# EAGLE schematic udayworks60 (EAGLE 9.6.2)
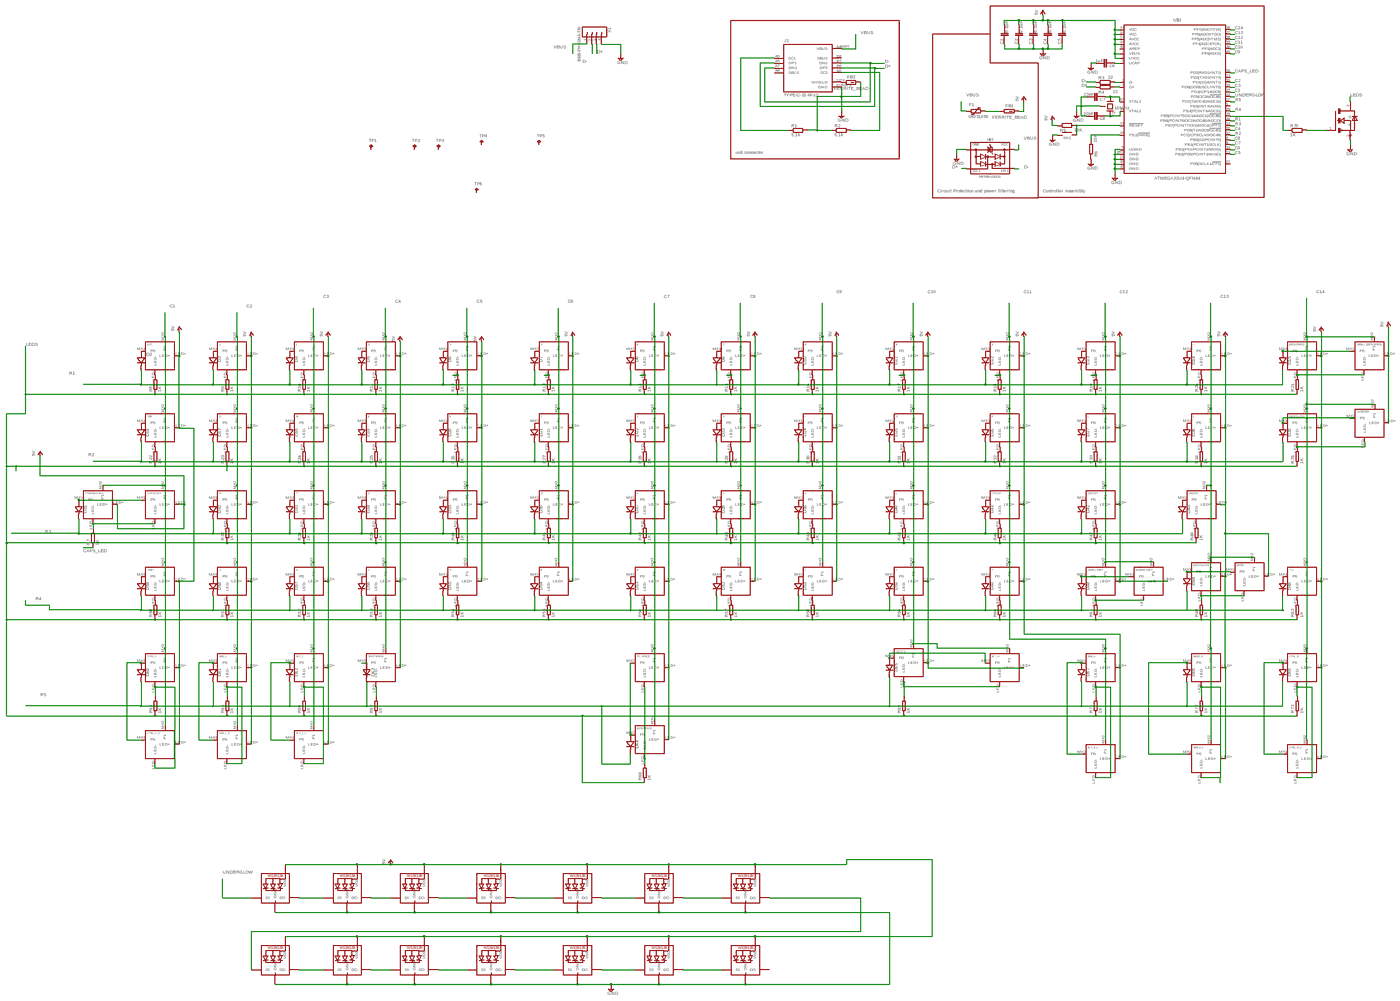
[diagram p0: schematic, sheet 1, overview]
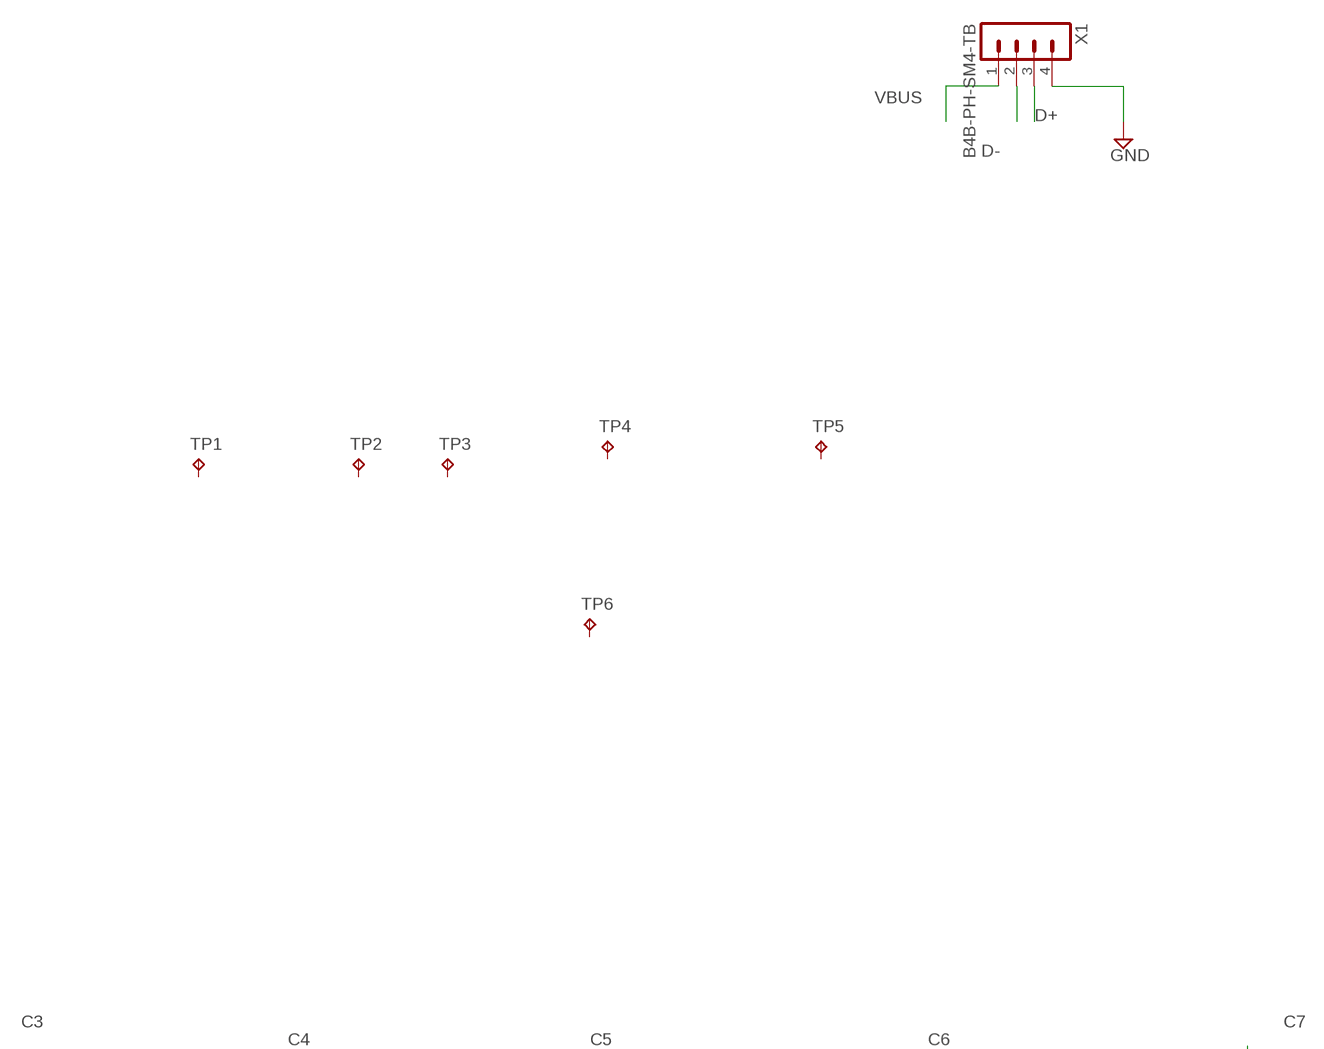
[diagram p1: schematic, sheet 1, part 1 of 4]
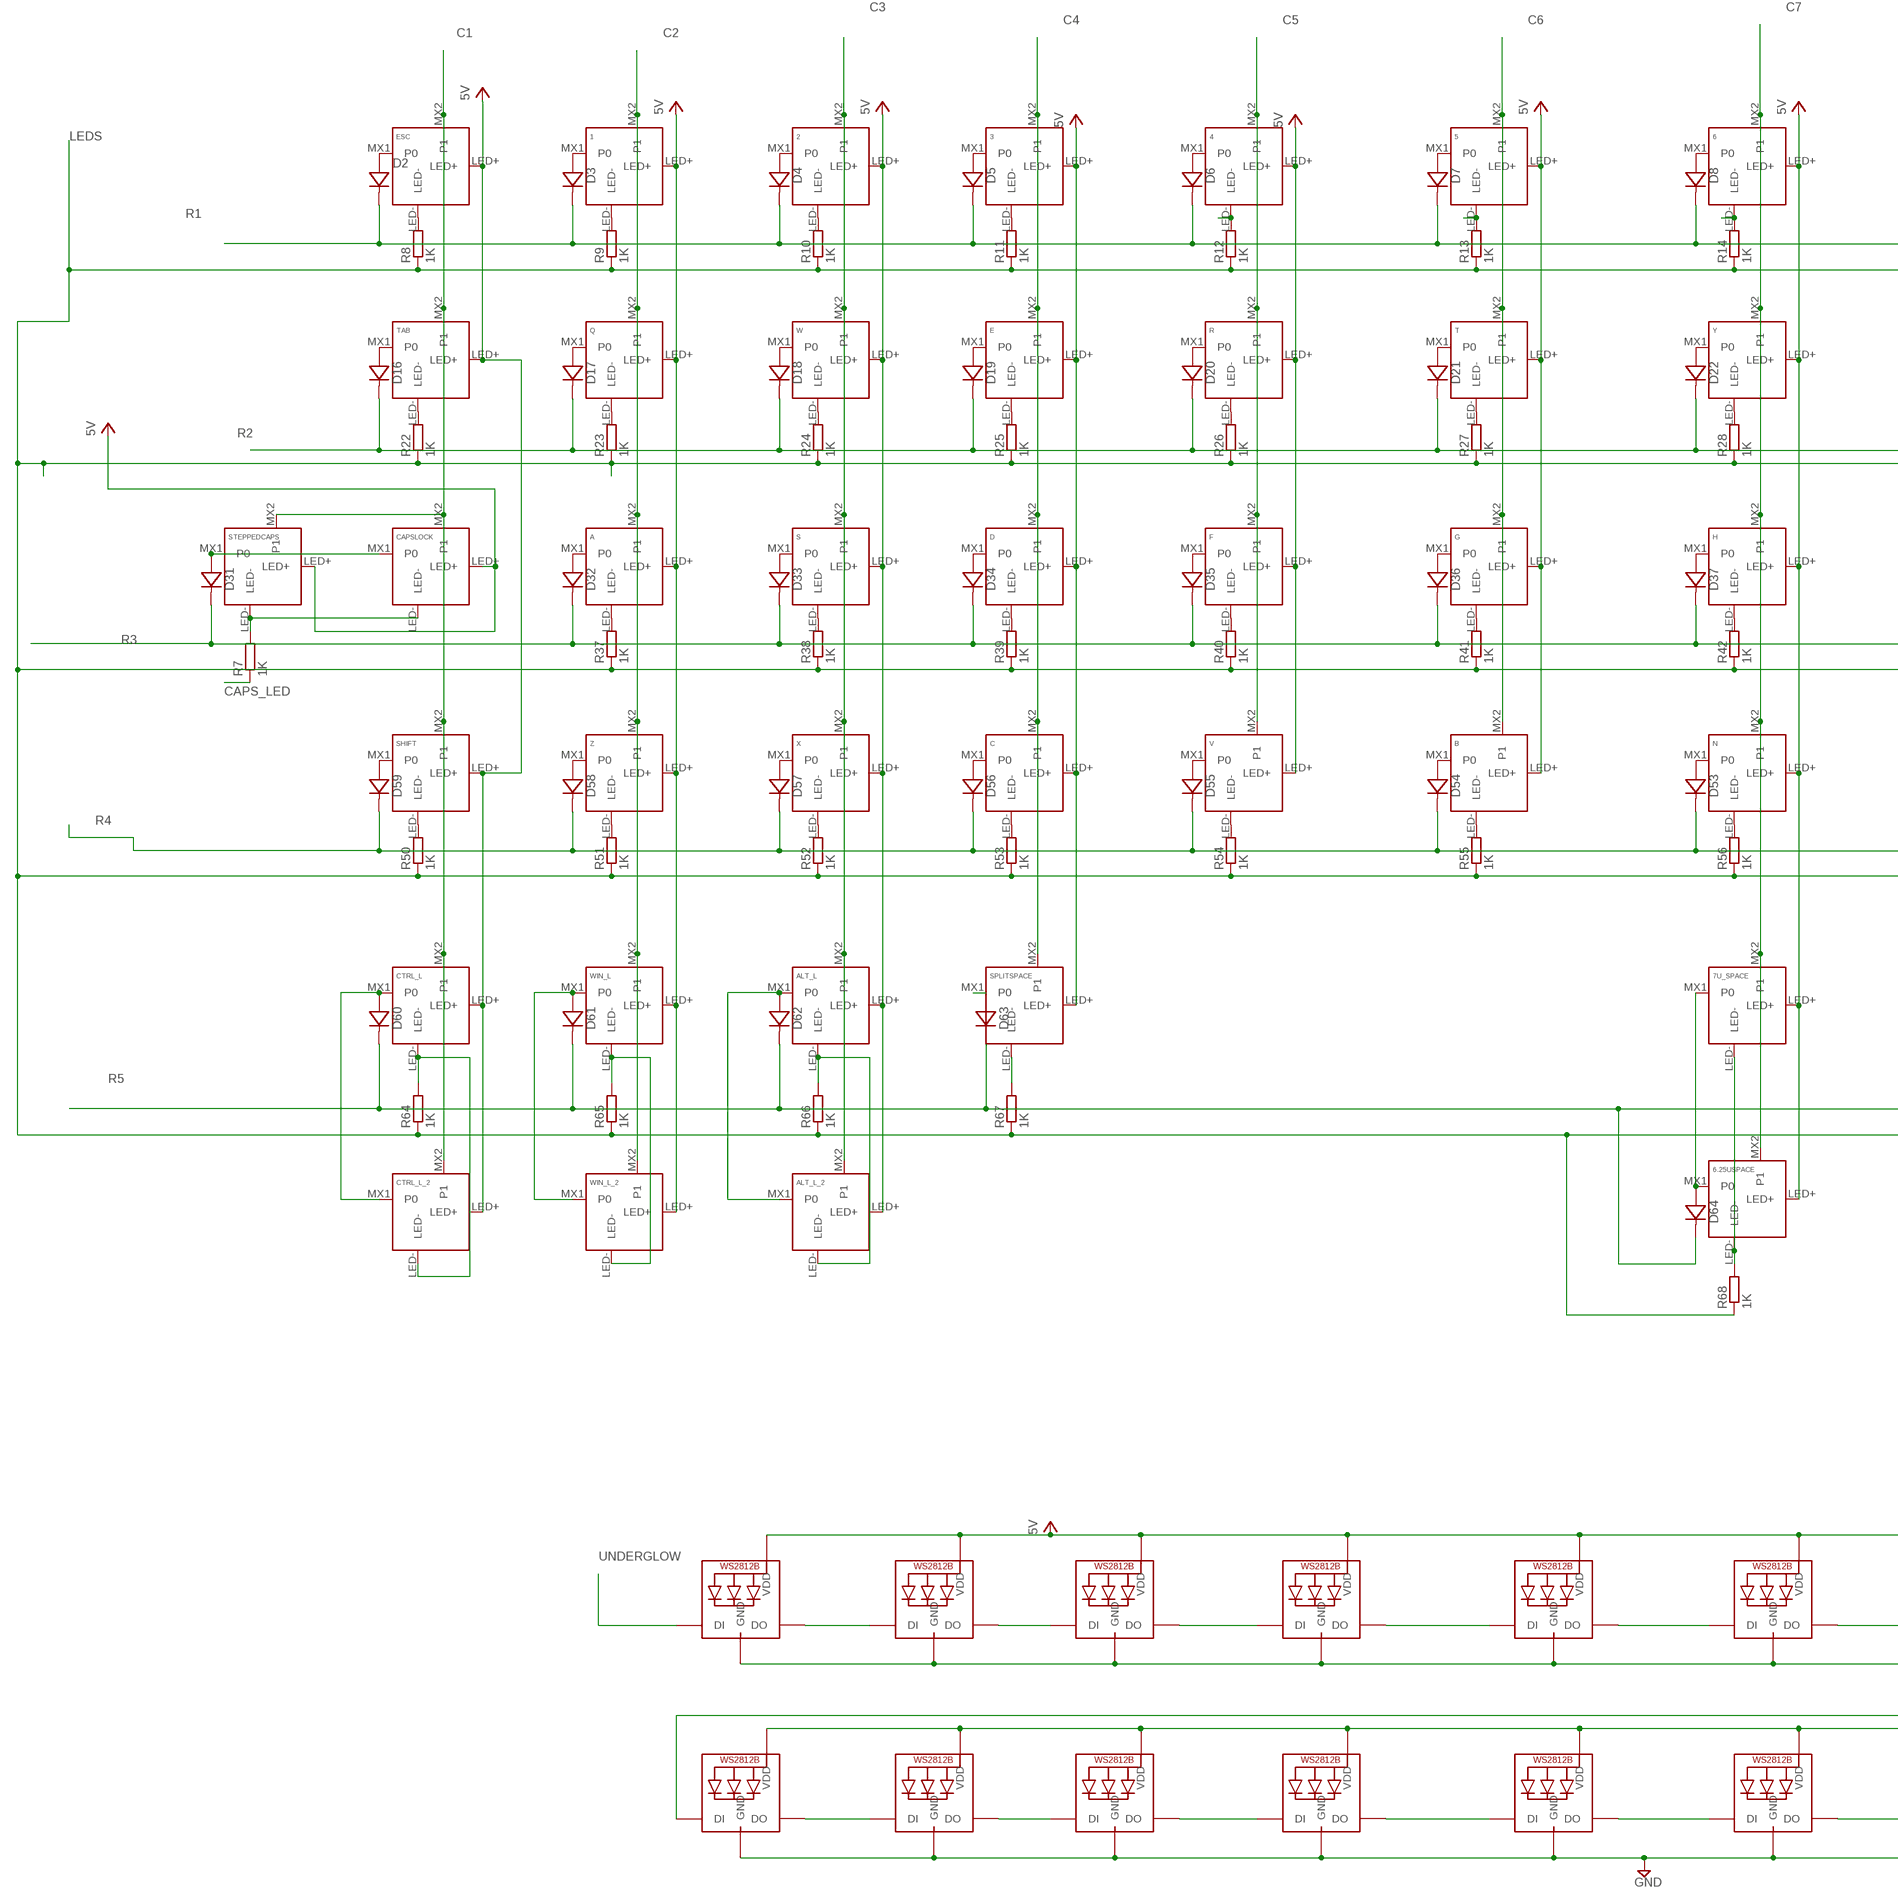
[diagram p2: schematic, sheet 1, part 2 of 4]
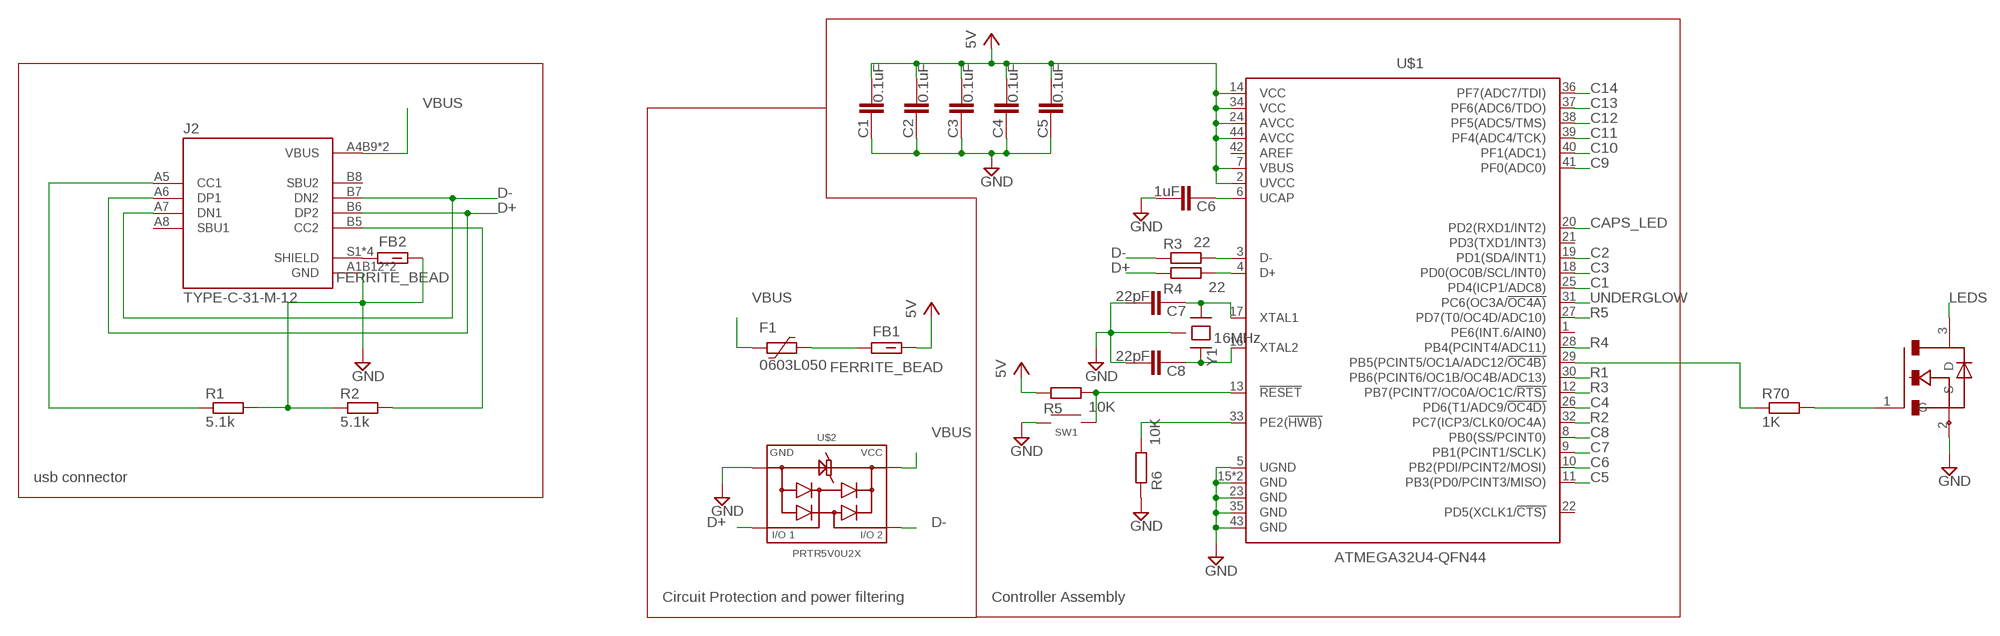
[diagram p3: schematic, sheet 1, part 3 of 4]
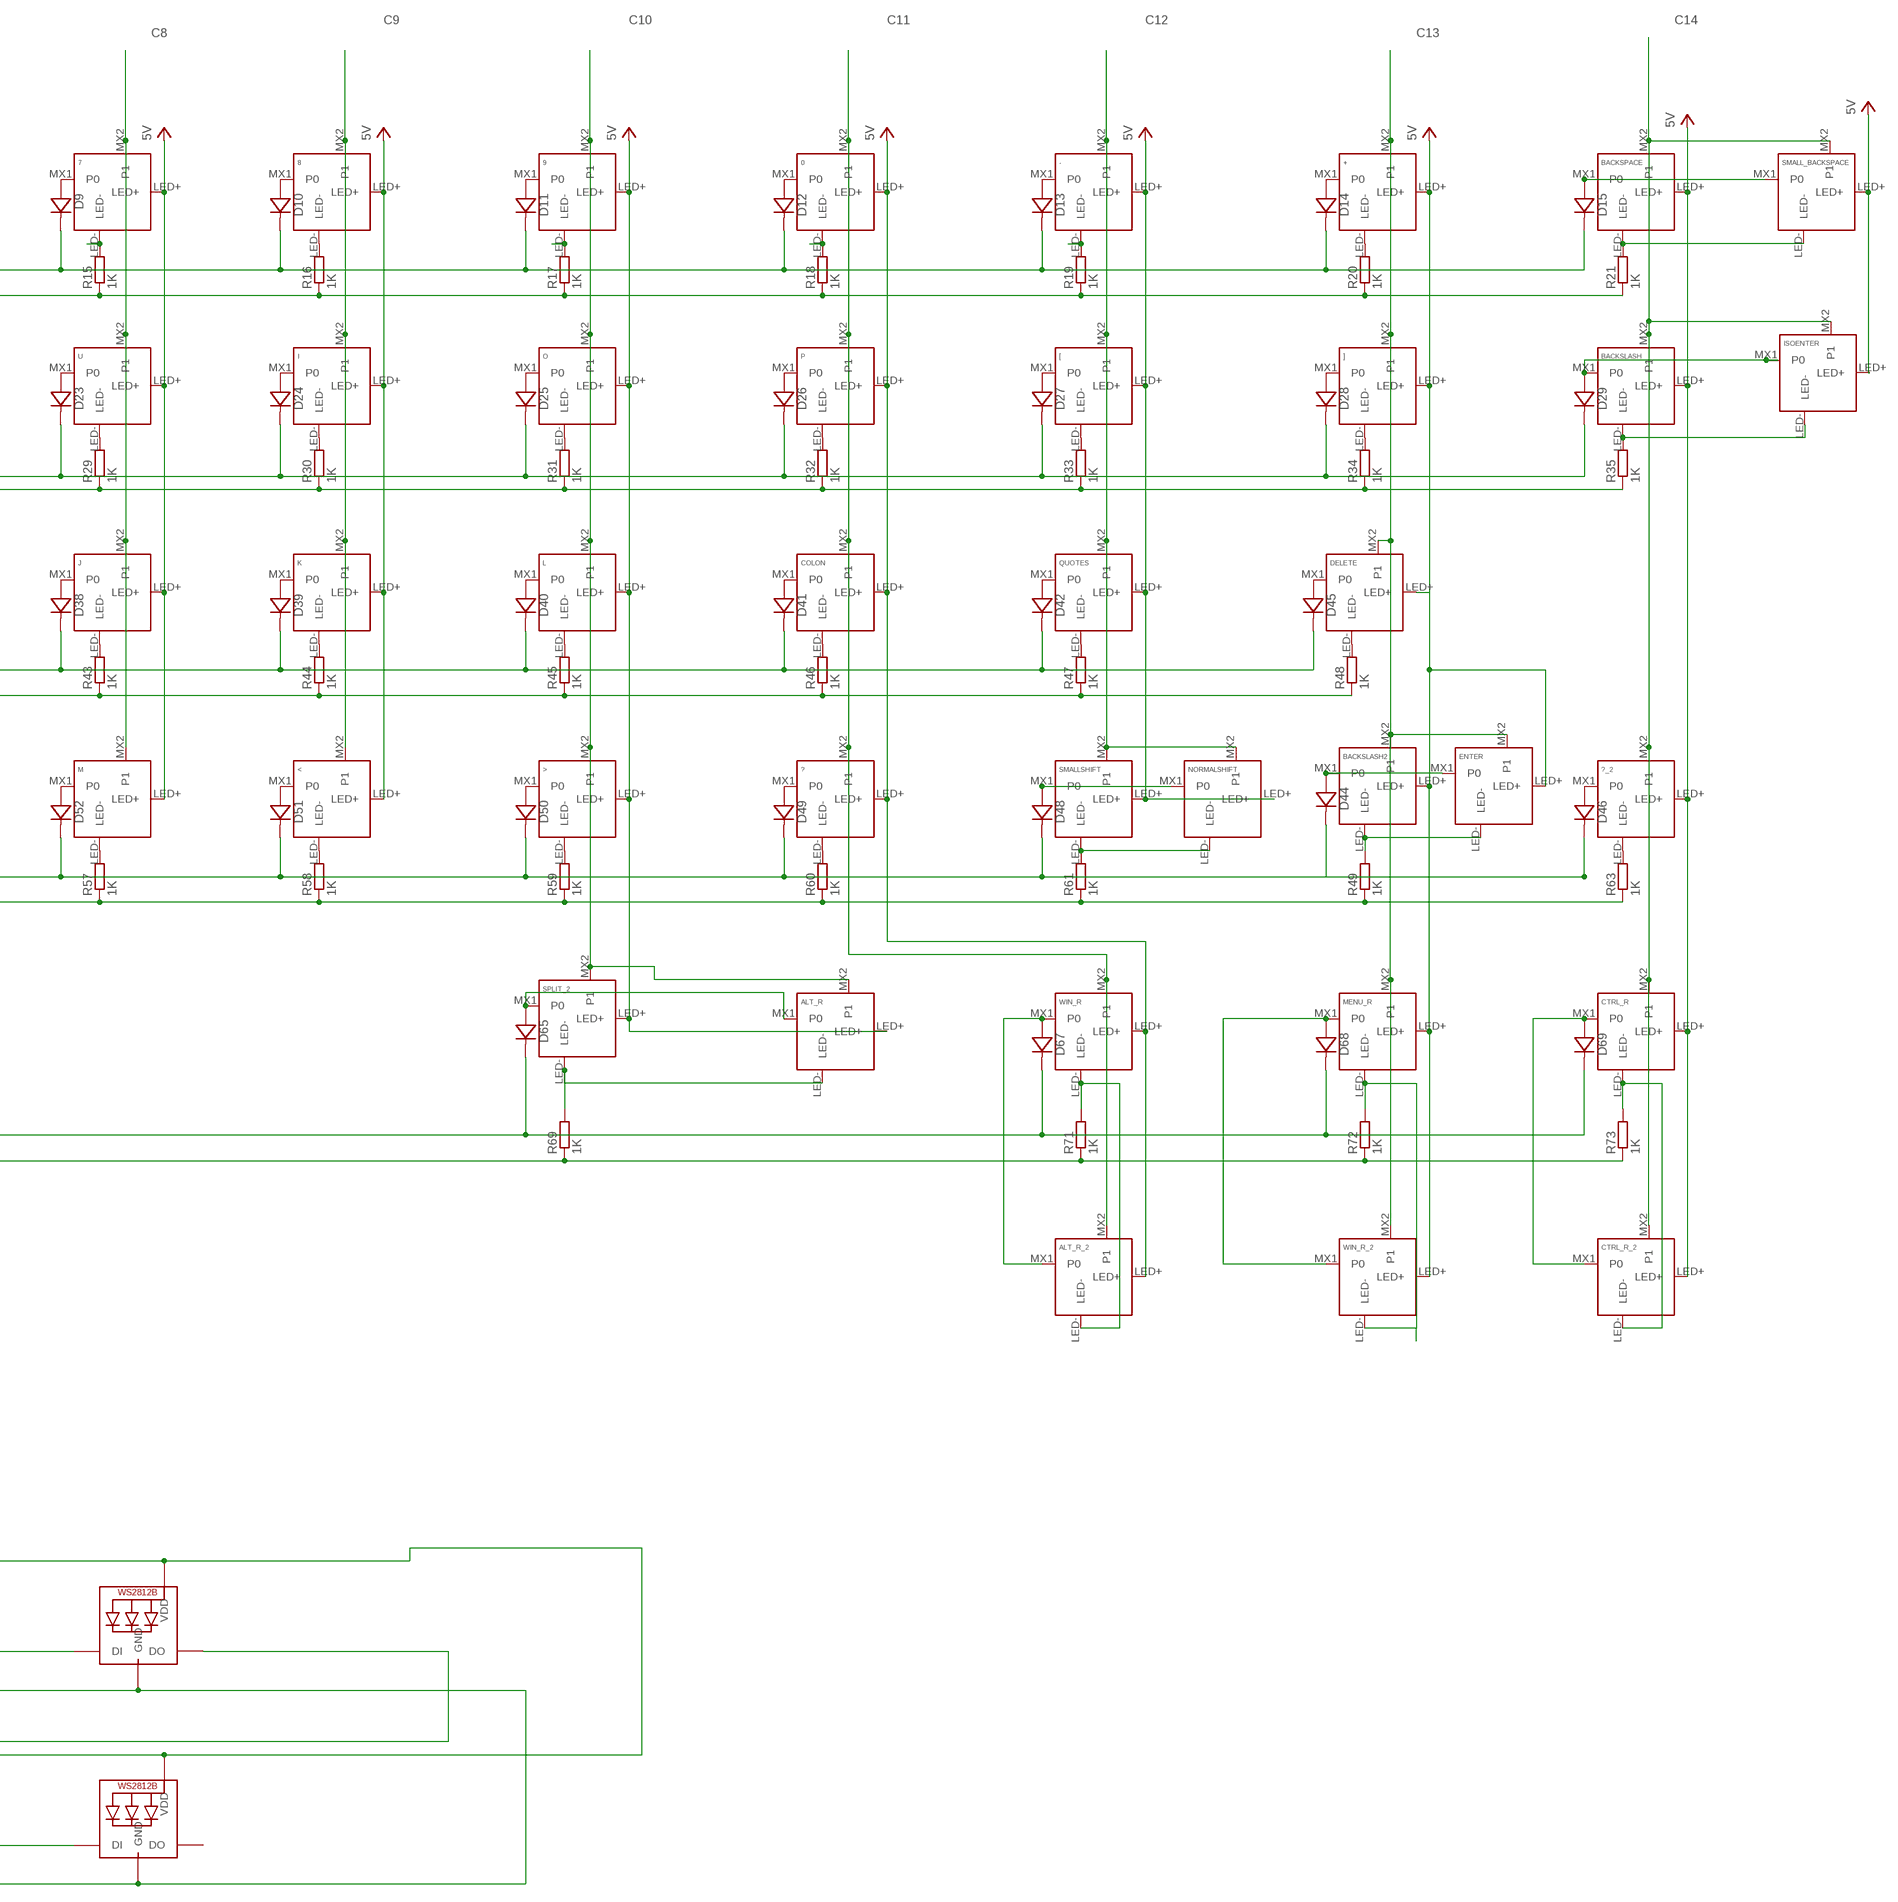
[diagram p4: schematic, sheet 1, part 4 of 4]

## Parts
0  KEYSWITCH-LED-MX-1U-LED  [MX-1U-LED]
1  KEYSWITCH-LED-MX-1U-LED  [MX-1U-LED]
2  KEYSWITCH-LED-MX-1U-LED  [MX-1U-LED]
3  KEYSWITCH-LED-MX-1U-LED  [MX-1U-LED]
4  KEYSWITCH-LED-MX-1U-LED  [MX-1U-LED]
5  KEYSWITCH-LED-MX-1U-LED  [MX-1U-LED]
6  KEYSWITCH-LED-MX-1U-LED  [MX-1U-LED]
6.25USPACE  KEYSWITCH-LED-MX-6.25U-LED-FLIPPED  [MX-6.25U-LED-FLIPPED]
7  KEYSWITCH-LED-MX-1U-LED  [MX-1U-LED]
7U_SPACE  KEYSWITCH-LED-MX-7U-LED-FLIPPED  [MX-7U-LED-FLIPPED]
8  KEYSWITCH-LED-MX-1U-LED  [MX-1U-LED]
9  KEYSWITCH-LED-MX-1U-LED  [MX-1U-LED]
+  KEYSWITCH-LED-MX-1U-LED  [MX-1U-LED]
-  KEYSWITCH-LED-MX-1U-LED  [MX-1U-LED]
<  KEYSWITCH-LED-MX-1U-LED  [MX-1U-LED]
>  KEYSWITCH-LED-MX-1U-LED  [MX-1U-LED]
?  KEYSWITCH-LED-MX-1U-LED  [MX-1U-LED]
?_2  KEYSWITCH-LED-MX-1U-LED  [MX-1U-LED]
[  KEYSWITCH-LED-MX-1U-LED  [MX-1U-LED]
]  KEYSWITCH-LED-MX-1U-LED  [MX-1U-LED]
A  KEYSWITCH-LED-MX-1U-LED  [MX-1U-LED]
ALT_L  KEYSWITCH-LED-MX-1U-LED  [MX-1U-LED]
ALT_L_2  KEYSWITCH-LED-MX-1U-LED  [MX-1U-LED]
ALT_R  KEYSWITCH-LED-MX-1U-LED  [MX-1U-LED]
ALT_R_2  KEYSWITCH-LED-MX-1U-LED  [MX-1U-LED]
B  KEYSWITCH-LED-MX-1U-LED  [MX-1U-LED]
BACKSLASH  KEYSWITCH-LED-MX-1U-LED  [MX-1U-LED]
BACKSLASH2  KEYSWITCH-LED-MX-1U-LED  [MX-1U-LED]
BACKSPACE  KEYSWITCH-LED-MX-2U-LED  [MX-2U-LED]
C  KEYSWITCH-LED-MX-1U-LED  [MX-1U-LED]
C1  0.1uF  CAPACITOR-0603  [C0603]
C2  0.1uF  CAPACITOR-0603  [C0603]
C3  0.1uF  CAPACITOR-0603  [C0603]
C4  0.1uF  CAPACITOR-0603  [C0603]
C5  0.1uF  CAPACITOR-0603  [C0603]
C6  1uF  CAPACITOR-0603  [C0603]
C7  22pF  CAPACITOR-0603  [C0603]
C8  22pF  CAPACITOR-0603  [C0603]
CAPSLOCK  KEYSWITCH-LED-MX-1U-LED  [MX-1U-LED]
COLON  KEYSWITCH-LED-MX-1U-LED  [MX-1U-LED]
CTRL_L  KEYSWITCH-LED-MX-1U-LED  [MX-1U-LED]
CTRL_L_2  KEYSWITCH-LED-MX-1U-LED  [MX-1U-LED]
CTRL_R  KEYSWITCH-LED-MX-1U-LED  [MX-1U-LED]
CTRL_R_2  KEYSWITCH-LED-MX-1U-LED  [MX-1U-LED]
D  KEYSWITCH-LED-MX-1U-LED  [MX-1U-LED]
D2  DIODE-SOD-123  [SOD-123]
D3  DIODE-SOD-123  [SOD-123]
D4  DIODE-SOD-123  [SOD-123]
D5  DIODE-SOD-123  [SOD-123]
D6  DIODE-SOD-123  [SOD-123]
D7  DIODE-SOD-123  [SOD-123]
D8  DIODE-SOD-123  [SOD-123]
D9  DIODE-SOD-123  [SOD-123]
D10  DIODE-SOD-123  [SOD-123]
D11  DIODE-SOD-123  [SOD-123]
D12  DIODE-SOD-123  [SOD-123]
D13  DIODE-SOD-123  [SOD-123]
D14  DIODE-SOD-123  [SOD-123]
D15  DIODE-SOD-123  [SOD-123]
D16  DIODE-SOD-123  [SOD-123]
D17  DIODE-SOD-123  [SOD-123]
D18  DIODE-SOD-123  [SOD-123]
D19  DIODE-SOD-123  [SOD-123]
D20  DIODE-SOD-123  [SOD-123]
D21  DIODE-SOD-123  [SOD-123]
D22  DIODE-SOD-123  [SOD-123]
D23  DIODE-SOD-123  [SOD-123]
D24  DIODE-SOD-123  [SOD-123]
D25  DIODE-SOD-123  [SOD-123]
D26  DIODE-SOD-123  [SOD-123]
D27  DIODE-SOD-123  [SOD-123]
D28  DIODE-SOD-123  [SOD-123]
D29  DIODE-SOD-123  [SOD-123]
D31  DIODE-SOD-123  [SOD-123]
D32  DIODE-SOD-123  [SOD-123]
D33  DIODE-SOD-123  [SOD-123]
D34  DIODE-SOD-123  [SOD-123]
D35  DIODE-SOD-123  [SOD-123]
D36  DIODE-SOD-123  [SOD-123]
D37  DIODE-SOD-123  [SOD-123]
D38  DIODE-SOD-123  [SOD-123]
D39  DIODE-SOD-123  [SOD-123]
D40  DIODE-SOD-123  [SOD-123]
D41  DIODE-SOD-123  [SOD-123]
D42  DIODE-SOD-123  [SOD-123]
D44  DIODE-SOD-123  [SOD-123]
D45  DIODE-SOD-123  [SOD-123]
D46  DIODE-SOD-123  [SOD-123]
D48  DIODE-SOD-123  [SOD-123]
D49  DIODE-SOD-123  [SOD-123]
D50  DIODE-SOD-123  [SOD-123]
D51  DIODE-SOD-123  [SOD-123]
D52  DIODE-SOD-123  [SOD-123]
D53  DIODE-SOD-123  [SOD-123]
D54  DIODE-SOD-123  [SOD-123]
D55  DIODE-SOD-123  [SOD-123]
D56  DIODE-SOD-123  [SOD-123]
D57  DIODE-SOD-123  [SOD-123]
D58  DIODE-SOD-123  [SOD-123]
D59  DIODE-SOD-123  [SOD-123]
D60  DIODE-SOD-123  [SOD-123]
D61  DIODE-SOD-123  [SOD-123]
D62  DIODE-SOD-123  [SOD-123]
D63  DIODE-SOD-123  [SOD-123]
D64  DIODE-SOD-123  [SOD-123]
D65  DIODE-SOD-123  [SOD-123]
D67  DIODE-SOD-123  [SOD-123]
D68  DIODE-SOD-123  [SOD-123]
D69  DIODE-SOD-123  [SOD-123]
DELETE  KEYSWITCH-LED-MX-1U-LED  [MX-1U-LED]
E  KEYSWITCH-LED-MX-1U-LED  [MX-1U-LED]
ENTER  KEYSWITCH-LED-MX-2U-LED  [MX-2U-LED]
ESC  KEYSWITCH-LED-MX-1U-LED  [MX-1U-LED]
F  KEYSWITCH-LED-MX-1U-LED  [MX-1U-LED]
F1  0603L050  [0603L]
FB1  FERRITE_BEAD  FBCHIP-0603(1608-METRIC)  [BEADC1608X95N]
FB2  FERRITE_BEAD  FBCHIP-0603(1608-METRIC)  [BEADC1608X95N]
FET1  FET-SOT-23-3  [SOT-23-3]
G  KEYSWITCH-LED-MX-1U-LED  [MX-1U-LED]
H  KEYSWITCH-LED-MX-1U-LED  [MX-1U-LED]
I  KEYSWITCH-LED-MX-1U-LED  [MX-1U-LED]
ISOENTER  KEYSWITCH-LED-MX-2U-LED-FLIPPED-ROTATED  [MX-2U-LED-FLIPPED-ROTATED]
J  KEYSWITCH-LED-MX-1U-LED  [MX-1U-LED]
J2  TYPE-C-31-M-12  [HRO_TYPE-C-31-M-12]
K  KEYSWITCH-LED-MX-1U-LED  [MX-1U-LED]
L  KEYSWITCH-LED-MX-1U-LED  [MX-1U-LED]
LED1  WS2812B3535  [LED3535]
LED2  WS2812B3535  [LED3535]
LED3  WS2812B3535  [LED3535]
LED4  WS2812B3535  [LED3535]
LED5  WS2812B3535  [LED3535]
LED6  WS2812B3535  [LED3535]
LED7  WS2812B3535  [LED3535]
LED9  WS2812B3535  [LED3535]
LED10  WS2812B3535  [LED3535]
LED11  WS2812B3535  [LED3535]
LED12  WS2812B3535  [LED3535]
LED13  WS2812B3535  [LED3535]
LED14  WS2812B3535  [LED3535]
LED15  WS2812B3535  [LED3535]
M  KEYSWITCH-LED-MX-1U-LED  [MX-1U-LED]
MENU_R  KEYSWITCH-LED-MX-1U-LED  [MX-1U-LED]
N  KEYSWITCH-LED-MX-1U-LED  [MX-1U-LED]
NORMALSHIFT  KEYSWITCH-LED-MX-2U-LED  [MX-2U-LED]
O  KEYSWITCH-LED-MX-1U-LED  [MX-1U-LED]
P  KEYSWITCH-LED-MX-1U-LED  [MX-1U-LED]
Q  KEYSWITCH-LED-MX-1U-LED  [MX-1U-LED]
QUOTES  KEYSWITCH-LED-MX-1U-LED  [MX-1U-LED]
R  KEYSWITCH-LED-MX-1U-LED  [MX-1U-LED]
R1  5.1k  RESISTOR-0603  [R0603]
R2  5.1k  RESISTOR-0603  [R0603]
R3  22  RESISTOR-0603  [R0603]
R4  22  RESISTOR-0603  [R0603]
R5  10K  RESISTOR-0603  [R0603]
R6  10K  RESISTOR-0603  [R0603]
R7  1K  RESISTOR-0603  [R0603]
R8  1K  RESISTOR-0603  [R0603]
R9  1K  RESISTOR-0603  [R0603]
R10  1K  RESISTOR-0603  [R0603]
R11  1K  RESISTOR-0603  [R0603]
R12  1K  RESISTOR-0603  [R0603]
R13  1K  RESISTOR-0603  [R0603]
R14  1K  RESISTOR-0603  [R0603]
R15  1K  RESISTOR-0603  [R0603]
R16  1K  RESISTOR-0603  [R0603]
R17  1K  RESISTOR-0603  [R0603]
R18  1K  RESISTOR-0603  [R0603]
R19  1K  RESISTOR-0603  [R0603]
R20  1K  RESISTOR-0603  [R0603]
R21  1K  RESISTOR-0603  [R0603]
R22  1K  RESISTOR-0603  [R0603]
R23  1K  RESISTOR-0603  [R0603]
R24  1K  RESISTOR-0603  [R0603]
R25  1K  RESISTOR-0603  [R0603]
R26  1K  RESISTOR-0603  [R0603]
R27  1K  RESISTOR-0603  [R0603]
R28  1K  RESISTOR-0603  [R0603]
R29  1K  RESISTOR-0603  [R0603]
R30  1K  RESISTOR-0603  [R0603]
R31  1K  RESISTOR-0603  [R0603]
R32  1K  RESISTOR-0603  [R0603]
R33  1K  RESISTOR-0603  [R0603]
R34  1K  RESISTOR-0603  [R0603]
R35  1K  RESISTOR-0603  [R0603]
R37  1K  RESISTOR-0603  [R0603]
R38  1K  RESISTOR-0603  [R0603]
R39  1K  RESISTOR-0603  [R0603]
R40  1K  RESISTOR-0603  [R0603]
R41  1K  RESISTOR-0603  [R0603]
R42  1K  RESISTOR-0603  [R0603]
R43  1K  RESISTOR-0603  [R0603]
R44  1K  RESISTOR-0603  [R0603]
R45  1K  RESISTOR-0603  [R0603]
R46  1K  RESISTOR-0603  [R0603]
R47  1K  RESISTOR-0603  [R0603]
R48  1K  RESISTOR-0603  [R0603]
R49  1K  RESISTOR-0603  [R0603]
R50  1K  RESISTOR-0603  [R0603]
R51  1K  RESISTOR-0603  [R0603]
R52  1K  RESISTOR-0603  [R0603]
R53  1K  RESISTOR-0603  [R0603]
R54  1K  RESISTOR-0603  [R0603]
R55  1K  RESISTOR-0603  [R0603]
R56  1K  RESISTOR-0603  [R0603]
R57  1K  RESISTOR-0603  [R0603]
R58  1K  RESISTOR-0603  [R0603]
R59  1K  RESISTOR-0603  [R0603]
R60  1K  RESISTOR-0603  [R0603]
R61  1K  RESISTOR-0603  [R0603]
R63  1K  RESISTOR-0603  [R0603]
R64  1K  RESISTOR-0603  [R0603]
R65  1K  RESISTOR-0603  [R0603]
R66  1K  RESISTOR-0603  [R0603]
R67  1K  RESISTOR-0603  [R0603]
R68  1K  RESISTOR-0603  [R0603]
R69  1K  RESISTOR-0603  [R0603]
R70  1K  RESISTOR-0603  [R0603]
R71  1K  RESISTOR-0603  [R0603]
R72  1K  RESISTOR-0603  [R0603]
R73  1K  RESISTOR-0603  [R0603]
S  KEYSWITCH-LED-MX-1U-LED  [MX-1U-LED]
SHIFT  KEYSWITCH-LED-MX-2U-LED  [MX-2U-LED]
SMALL_BACKSPACE  KEYSWITCH-LED-MX-1U-LED  [MX-1U-LED]
SMALLSHIFT  KEYSWITCH-LED-MX-1U-LED  [MX-1U-LED]
SPLIT_2  KEYSWITCH-LED-MX-2U-LED-FLIPPED  [MX-2U-LED-FLIPPED]
SPLITSPACE  KEYSWITCH-LED-MX-2U-LED-FLIPPED  [MX-2U-LED-FLIPPED]
STEPPEDCAPS  KEYSWITCH-LED-MX-1U-LED  [MX-1U-LED]
SW1  SWITCH-SMD-EVP-BB2A9B00  [SWITCH-SMD-EVP-BB2A9B00]
T  KEYSWITCH-LED-MX-1U-LED  [MX-1U-LED]
TAB  KEYSWITCH-LED-MX-1U-LED  [MX-1U-LED]
TP1  TPPAD1-17Y  [P1-17Y]
TP2  TPPAD1-17Y  [P1-17Y]
TP3  TPPAD1-17Y  [P1-17Y]
TP4  TPPAD1-17Y  [P1-17Y]
TP5  TPPAD1-17Y  [P1-17Y]
TP6  TPPAD1-17Y  [P1-17Y]
U  KEYSWITCH-LED-MX-1U-LED  [MX-1U-LED]
U$1  ATMEGA32U4-QFN44  [QFN-44]
U$2  PRTR5V0U2X  [PRTR5V0U2X]
V  KEYSWITCH-LED-MX-1U-LED  [MX-1U-LED]
W  KEYSWITCH-LED-MX-1U-LED  [MX-1U-LED]
WIN_L  KEYSWITCH-LED-MX-1U-LED  [MX-1U-LED]
WIN_L_2  KEYSWITCH-LED-MX-1U-LED  [MX-1U-LED]
WIN_R  KEYSWITCH-LED-MX-1U-LED  [MX-1U-LED]
WIN_R_2  KEYSWITCH-LED-MX-1U-LED  [MX-1U-LED]
X  KEYSWITCH-LED-MX-1U-LED  [MX-1U-LED]
X1  B4B-PH-SM4-TB  [B4B-PH-SM4-TB]
Y  KEYSWITCH-LED-MX-1U-LED  [MX-1U-LED]
Y1  16MHz  CRYSTAL-4PIN-3.2X2.5  [CRYSTAL-3.2X2.5]
Z  KEYSWITCH-LED-MX-1U-LED  [MX-1U-LED]

## Nets
C1: CAPSLOCK.MX2(P1) CTRL_L.MX2(P1) CTRL_L_2.MX2(P1) ESC.MX2(P1) SHIFT.MX2(P1) STEPPEDCAPS.MX2(P1) TAB.MX2(P1) U$1.25(PD4(ICP1/ADC8))
C2: 1.MX2(P1) A.MX2(P1) Q.MX2(P1) U$1.19(PD1(SDA/INT1)) WIN_L.MX2(P1) WIN_L_2.MX2(P1) Z.MX2(P1)
C3: 2.MX2(P1) ALT_L.MX2(P1) ALT_L_2.MX2(P1) S.MX2(P1) U$1.18(PD0(OC0B/SCL/INT0)) W.MX2(P1) X.MX2(P1)
C4: 3.MX2(P1) C.MX2(P1) D.MX2(P1) E.MX2(P1) SPLITSPACE.MX2(P1) U$1.26(PD6(T1/ADC9/!OC4D))
C5: 4.MX2(P1) F.MX2(P1) R.MX2(P1) U$1.11(PB3(PD0/PCINT3/MISO)) V.MX2(P1)
C6: 5.MX2(P1) B.MX2(P1) G.MX2(P1) T.MX2(P1) U$1.10(PB2(PDI/PCINT2/MOSI))
C7: 6.25USPACE.MX2(P1) 6.MX2(P1) 7U_SPACE.MX2(P1) H.MX2(P1) N.MX2(P1) U$1.9(PB1(PCINT1/SCLK)) Y.MX2(P1)
C8: 7.MX2(P1) J.MX2(P1) M.MX2(P1) U$1.8(PB0(SS/PCINT0)) U.MX2(P1)
C9: 8.MX2(P1) <.MX2(P1) I.MX2(P1) K.MX2(P1) U$1.41(PF0(ADC0))
C10: 9.MX2(P1) >.MX2(P1) ALT_R.MX2(P1) L.MX2(P1) O.MX2(P1) SPLIT_2.MX2(P1) U$1.40(PF1(ADC1))
C11: 0.MX2(P1) ?.MX2(P1) ALT_R_2.MX2(P1) COLON.MX2(P1) P.MX2(P1) U$1.39(PF4(ADC4/TCK)) WIN_R.MX2(P1)
C12: -.MX2(P1) [.MX2(P1) NORMALSHIFT.MX2(P1) QUOTES.MX2(P1) SMALLSHIFT.MX2(P1) U$1.38(PF5(ADC5/TMS))
C13: +.MX2(P1) ].MX2(P1) BACKSLASH2.MX2(P1) DELETE.MX2(P1) ENTER.MX2(P1) MENU_R.MX2(P1) U$1.37(PF6(ADC6/TDO)) WIN_R_2.MX2(P1)
C14: ?_2.MX2(P1) BACKSLASH.MX2(P1) BACKSPACE.MX2(P1) CTRL_R.MX2(P1) CTRL_R_2.MX2(P1) ISOENTER.MX2(P1) SMALL_BACKSPACE.MX2(P1) U$1.36(PF7(ADC7/TDI))
CAPS_LED: R7.1 U$1.20(PD2(RXD1/INT2))
D+: J2.A6(DP1) J2.B6(DP2) R4.1 U$2.2 X1.3
D-: J2.A7(DN1) J2.B7(DN2) R3.1 U$2.3 X1.2
GND: C1.1 C2.1 C3.1 C4.1 C5.1 C6.2 C7.2 C8.2 FB2.2 FET1.2(S) J2.A1B12(GND) J2.B1A12(GND) LED1.4(GND) LED2.4(GND) LED3.4(GND) LED4.4(GND) LED5.4(GND) LED6.4(GND) LED7.4(GND) LED9.4(GND) LED10.4(GND) LED11.4(GND) LED12.4(GND) LED13.4(GND) LED14.4(GND) LED15.4(GND) R1.2 R2.1 R6.1 SW1.A@1 SW1.A@2 U$1.5(UGND) U$1.15(GND) U$1.23(GND) U$1.35(GND) U$1.43(GND) U$1.TAB(GND) U$2.1 X1.4 Y1.2(GND) Y1.4(GND)
LEDS: FET1.3(D) R8.1 R9.1 R10.1 R11.1 R12.1 R13.1 R14.1 R15.1 R16.1 R17.1 R18.1 R19.1 R20.1 R21.1 R22.1 R23.1 R24.1 R25.1 R26.1 R27.1 R28.1 R29.1 R30.1 R31.1 R32.1 R33.1 R34.1 R35.1 R37.1 R38.1 R39.1 R40.1 R41.1 R42.1 R43.1 R44.1 R45.1 R46.1 R47.1 R48.1 R49.1 R50.1 R51.1 R52.1 R53.1 R54.1 R55.1 R56.1 R57.1 R58.1 R59.1 R60.1 R61.1 R63.1 R64.1 R65.1 R66.1 R67.1 R68.1 R69.1 R71.1 R72.1 R73.1
N$1: D2.A ESC.MX1(P0)
N$2: 1.MX1(P0) D3.A
N$3: 2.MX1(P0) D4.A
N$4: 3.MX1(P0) D5.A
N$5: 4.MX1(P0) D6.A
N$6: 5.MX1(P0) D7.A
N$7: 6.MX1(P0) D8.A
N$8: 7.MX1(P0) D9.A
N$9: 8.MX1(P0) D10.A
N$10: 9.MX1(P0) D11.A
N$11: 0.MX1(P0) D12.A
N$12: -.MX1(P0) D13.A
N$13: +.MX1(P0) D14.A
N$14: D16.A TAB.MX1(P0)
N$15: D17.A Q.MX1(P0)
N$16: D18.A W.MX1(P0)
N$17: D19.A E.MX1(P0)
N$18: D20.A R.MX1(P0)
N$19: D21.A T.MX1(P0)
N$20: D22.A Y.MX1(P0)
N$21: D23.A U.MX1(P0)
N$22: D24.A I.MX1(P0)
N$23: D25.A O.MX1(P0)
N$24: D26.A P.MX1(P0)
N$25: [.MX1(P0) D27.A
N$26: ].MX1(P0) D28.A
N$28: CAPSLOCK.MX1(P0) D31.A STEPPEDCAPS.MX1(P0)
N$29: A.MX1(P0) D32.A
N$30: D33.A S.MX1(P0)
N$31: D34.A D.MX1(P0)
N$32: D35.A F.MX1(P0)
N$33: D36.A G.MX1(P0)
N$34: D37.A H.MX1(P0)
N$35: D38.A J.MX1(P0)
N$36: D39.A K.MX1(P0)
N$37: D40.A L.MX1(P0)
N$38: COLON.MX1(P0) D41.A
N$39: D42.A QUOTES.MX1(P0)
N$40: D58.A Z.MX1(P0)
N$41: D57.A X.MX1(P0)
N$42: C.MX1(P0) D56.A
N$43: D55.A V.MX1(P0)
N$44: B.MX1(P0) D54.A
N$45: D53.A N.MX1(P0)
N$46: D52.A M.MX1(P0)
N$47: <.MX1(P0) D51.A
N$48: >.MX1(P0) D50.A
N$49: ?.MX1(P0) D49.A
N$50: D48.A NORMALSHIFT.MX1(P0) SMALLSHIFT.MX1(P0)
N$51: CTRL_L.MX1(P0) CTRL_L_2.MX1(P0) D60.A
N$52: D61.A WIN_L.MX1(P0) WIN_L_2.MX1(P0)
N$53: ALT_L.MX1(P0) ALT_L_2.MX1(P0) D62.A
N$54: CAPSLOCK.LED- R7.2 STEPPEDCAPS.LED-
N$55: ALT_R_2.MX1(P0) D67.A WIN_R.MX1(P0)
N$56: D68.A MENU_R.MX1(P0) WIN_R_2.MX1(P0)
N$57: CTRL_R.MX1(P0) CTRL_R_2.MX1(P0) D69.A
N$58: BACKSLASH2.MX1(P0) D44.A ENTER.MX1(P0)
N$59: DELETE.LED- R48.2
N$60: ?_2.MX1(P0) D46.A
N$61: D59.A SHIFT.MX1(P0)
N$62: 6.25USPACE.MX1(P0) 7U_SPACE.MX1(P0) D64.A
N$63: BACKSPACE.MX1(P0) D15.A SMALL_BACKSPACE.MX1(P0)
N$64: BACKSLASH.MX1(P0) D29.A ISOENTER.MX1(P0)
N$65: D63.A SPLITSPACE.MX1(P0)
N$66: ALT_R.MX1(P0) D65.A SPLIT_2.MX1(P0)
N$67: C6.1 U$1.6(UCAP)
N$68: R3.2 U$1.3(D-)
N$69: R4.2 U$1.4(D+)
N$70: Q.LED- R23.2
N$71: C7.1 U$1.17(XTAL1) Y1.1
N$72: FB2.1 J2.S1(SHIELD) J2.S2(SHIELD) J2.S3(SHIELD) J2.S4(SHIELD)
N$73: C8.1 U$1.16(XTAL2) Y1.3
N$74: R5.2 SW1.B@3 SW1.B@4 U$1.13(!RESET)
N$75: R6.2 U$1.33(PE2(!HWB))
N$76: F1.1 FB1.1
N$77: D45.A DELETE.MX1(P0)
N$78: 4.LED- R12.2
N$79: 5.LED- R13.2
N$80: 6.LED- R14.2
N$81: 7.LED- R15.2
N$82: 9.LED- R17.2
N$83: R70.1 U$1.29(PB5(PCINT5/OC1A/ADC12/!OC4B))
N$84: 0.LED- R18.2
N$85: -.LED- R19.2
N$86: FET1.1(G) R70.2
N$87: ESC.LED- R8.2
N$88: 1.LED- R9.2
N$89: A.LED- R37.2
N$90: R22.2 TAB.LED-
N$91: R24.2 W.LED-
N$92: E.LED- R25.2
N$93: R26.2 R.LED-
N$94: 2.LED- R10.2
N$95: 3.LED- R11.2
N$96: 8.LED- R16.2
N$97: +.LED- R20.2
N$98: BACKSPACE.LED- R21.2 SMALL_BACKSPACE.LED-
N$99: R27.2 T.LED-
N$100: R28.2 Y.LED-
N$101: R29.2 U.LED-
N$102: I.LED- R30.2
N$103: O.LED- R31.2
N$104: P.LED- R32.2
N$105: [.LED- R33.2
N$106: ].LED- R34.2
N$107: BACKSLASH.LED- ISOENTER.LED- R35.2
N$109: R38.2 S.LED-
N$110: ?_2.LED- R63.2
N$112: NORMALSHIFT.LED- R61.2 SMALLSHIFT.LED-
N$113: ?.LED- R60.2
N$114: >.LED- R59.2
N$115: <.LED- R58.2
N$116: M.LED- R57.2
N$117: N.LED- R56.2
N$118: B.LED- R55.2
N$119: R54.2 V.LED-
N$120: C.LED- R53.2
N$121: R52.2 X.LED-
N$122: R51.2 Z.LED-
N$123: R50.2 SHIFT.LED-
N$124: D.LED- R39.2
N$125: CTRL_R.LED- CTRL_R_2.LED- R73.2
N$126: 6.25USPACE.LED- 7U_SPACE.LED- R68.2
N$127: ALT_R.LED- R69.2 SPLIT_2.LED-
N$128: ALT_R_2.LED- R71.2 WIN_R.LED-
N$129: MENU_R.LED- R72.2 WIN_R_2.LED-
N$130: F.LED- R40.2
N$131: G.LED- R41.2
N$132: R67.2 SPLITSPACE.LED-
N$133: ALT_L.LED- ALT_L_2.LED- R66.2
N$134: R65.2 WIN_L.LED- WIN_L_2.LED-
N$135: LED9.3(DO) LED10.1(DI)
N$136: H.LED- R42.2
N$137: J.LED- R43.2
N$138: K.LED- R44.2
N$139: L.LED- R45.2
N$140: COLON.LED- R46.2
N$141: QUOTES.LED- R47.2
N$143: BACKSLASH2.LED- ENTER.LED- R49.2
N$144: CTRL_L.LED- CTRL_L_2.LED- R64.2
N$145: J2.A5(CC1) R1.1
N$147: J2.B5(CC2) R2.2
N$149: LED10.3(DO) LED11.1(DI)
N$152: LED11.3(DO) LED12.1(DI)
N$153: LED12.3(DO) LED13.1(DI)
N$155: LED1.3(DO) LED2.1(DI)
N$156: LED2.3(DO) LED3.1(DI)
N$157: LED3.3(DO) LED4.1(DI)
N$158: LED4.3(DO) LED5.1(DI)
N$159: LED5.3(DO) LED6.1(DI)
N$160: LED6.3(DO) LED7.1(DI)
N$161: LED7.3(DO) LED9.1(DI)
N$165: LED13.3(DO) LED14.1(DI)
N$166: LED14.3(DO) LED15.1(DI)
R1: D2.C D3.C D4.C D5.C D6.C D7.C D8.C D9.C D10.C D11.C D12.C D13.C D14.C D15.C U$1.30(PB6(PCINT6/OC1B/OC4B/ADC13))
R2: D16.C D17.C D18.C D19.C D20.C D21.C D22.C D23.C D24.C D25.C D26.C D27.C D28.C D29.C U$1.32(PC7(ICP3/CLK0/OC4A))
R3: D31.C D32.C D33.C D34.C D35.C D36.C D37.C D38.C D39.C D40.C D41.C D42.C D45.C U$1.12(PB7(PCINT7/OC0A/OC1C/!RTS))
R4: D44.C D46.C D48.C D49.C D50.C D51.C D52.C D53.C D54.C D55.C D56.C D57.C D58.C D59.C U$1.28(PB4(PCINT4/ADC11))
R5: D60.C D61.C D62.C D63.C D64.C D65.C D67.C D68.C D69.C U$1.27(PD7(T0/OC4D/ADC10))
UNDERGLOW: LED1.1(DI) U$1.31(PC6(OC3A/!OC4A))
VBUS: F1.2 J2.A4B9(VBUS) J2.B4A9(VBUS) U$2.4 X1.1
VCC: 0.LED+ 1.LED+ 2.LED+ 3.LED+ 4.LED+ 5.LED+ 6.25USPACE.LED+ 6.LED+ 7.LED+ 7U_SPACE.LED+ 8.LED+ 9.LED+ +.LED+ -.LED+ <.LED+ >.LED+ ?.LED+ ?_2.LED+ [.LED+ ].LED+ A.LED+ ALT_L.LED+ ALT_L_2.LED+ ALT_R.LED+ ALT_R_2.LED+ B.LED+ BACKSLASH2.LED+ BACKSLASH.LED+ BACKSPACE.LED+ C1.2 C2.2 C3.2 C4.2 C5.2 C.LED+ CAPSLOCK.LED+ COLON.LED+ CTRL_L.LED+ CTRL_L_2.LED+ CTRL_R.LED+ CTRL_R_2.LED+ D.LED+ DELETE.LED+ E.LED+ ENTER.LED+ ESC.LED+ F.LED+ FB1.2 G.LED+ H.LED+ I.LED+ ISOENTER.LED+ J.LED+ K.LED+ L.LED+ LED1.2(VDD) LED2.2(VDD) LED3.2(VDD) LED4.2(VDD) LED5.2(VDD) LED6.2(VDD) LED7.2(VDD) LED9.2(VDD) LED10.2(VDD) LED11.2(VDD) LED12.2(VDD) LED13.2(VDD) LED14.2(VDD) LED15.2(VDD) M.LED+ MENU_R.LED+ N.LED+ NORMALSHIFT.LED+ O.LED+ P.LED+ Q.LED+ QUOTES.LED+ R5.1 R.LED+ S.LED+ SHIFT.LED+ SMALL_BACKSPACE.LED+ SMALLSHIFT.LED+ SPLIT_2.LED+ SPLITSPACE.LED+ STEPPEDCAPS.LED+ T.LED+ TAB.LED+ U$1.2(UVCC) U$1.7(VBUS) U$1.14(VCC) U$1.24(AVCC) U$1.34(VCC) U$1.44(AVCC) U.LED+ V.LED+ W.LED+ WIN_L.LED+ WIN_L_2.LED+ WIN_R.LED+ WIN_R_2.LED+ X.LED+ Y.LED+ Z.LED+ ; supply symbol labelled 5V
Unconnected: J2.A8(SBU1) J2.B8(SBU2) LED15.3(DO) TP1.TP TP2.TP TP3.TP TP4.TP TP5.TP TP6.TP U$1.1(PE6(INT.6/AIN0)) U$1.21(PD3(TXD1/INT3)) U$1.22(PD5(XCLK1/!CTS)) U$1.42(AREF)

## Notes on the sheet
- usb connector
- Circuit Protection and power filtering | Controller Assembly

## Library data of the parts
0 1-6 6.25USPACE 7 7U_SPACE 8 9 + - < > ? ?_2 [ ] A ALT_L ALT_L_2 ALT_R ALT_R_2 B BACKSLASH BACKSLASH2 BACKSPACE C CAPSLOCK COLON CTRL_L CTRL_L_2 CTRL_R CTRL_R_2 D DELETE E ENTER ESC F G H I ISOENTER J K L M MENU_R N NORMALSHIFT O P Q QUOTES R S SHIFT SMALL_BACKSPACE SMALLSHIFT SPLIT_2 SPLITSPACE STEPPEDCAPS T TAB U V W WIN_L WIN_L_2 WIN_R WIN_R_2 X Y Z = Keyboard:KEYSWITCH-LED
C1-C8 = Components:CAPACITOR
D2-D29 D31-D42 D44-D46 D48-D65 D67-D69 = Components:DIODE: Standard 1N4148 diode
F1 = polyfuse-smd_20:?: Polyfuse Resettable PTC Source: http://www.littelfuse.com/products/resettable-ptcs.aspx; MF: Littelfuse; MPN: 0603L050; OC_FARNELL: 2125904; OC_NEWARK: 88T7683
FB1 FB2 = Filter:FB: Ferrite Bead - Generic; CATEGORY: Filter; SUB-CATEGORY: Ferrite bead
FET1 = Components:FET
J2 = TYPE-C-31-M-12:TYPE-C-31-M-12: USB Connectors 24 Receptacle 1 8.94*7.3mm RoHS; AVAILABILITY: Unavailable; DESCRIPTION: USB Connectors 24 Receptacle 1 8.94*7.3mm RoHS; MF: HRO Electronics Co., Ltd.; MP: TYPE-C-31-M-12; PACKAGE: Package; PRICE: None
LED1-LED7 LED9-LED15 = WS2812B:WS2812B; AVAILABILITY: Unavailable; DESCRIPTION: Raspberry Pi HAT (40 pin) Wheeled Robotics Kit; MF: SparkFun Electronics; MP: WS2812B; PACKAGE: None; PRICE: None
R1-R35 R37-R61 R63-R73 = Components:RESISTOR
SW1 = Controller:SWITCH-SMD
TP1-TP6 = testpad:TP: Test pad
U$1 = Controller:ATMEGA32U4
U$2 = Controller:PRTR5V0U2X
X1 = con-JST PH:B4B-PH: JST PH series header 2.00mm pitch disconnectable crimp style connectors, vertical (side entry type), 4 pins
Y1 = Components:CRYSTAL-4PIN